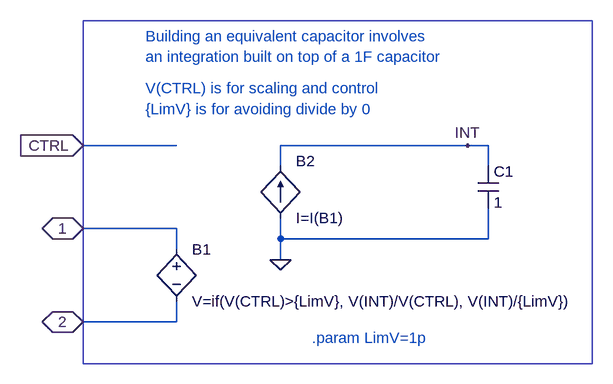
[diagram p0: schematic Varicap.asc]
Varicap.asc, the LTspice schematic file:
Version 4
SHEET 1 880 680
WIRE 112 -64 -32 -64
WIRE 560 -64 272 -64
WIRE 592 -64 560 -64
WIRE 272 -32 272 -64
WIRE 592 -32 592 -64
WIRE 112 64 -32 64
WIRE 272 80 272 48
WIRE 592 80 592 32
WIRE 592 80 272 80
WIRE 112 96 112 64
WIRE 272 112 272 80
WIRE 112 208 112 176
WIRE 112 208 -32 208
FLAG -32 64 1
IOPIN -32 64 BiDir
FLAG -32 208 2
IOPIN -32 208 BiDir
FLAG 272 112 0
FLAG -32 -64 CTRL
IOPIN -32 -64 In
FLAG 560 -64 INT
SYMBOL bv 112 80 R0
SYMATTR InstName B1
SYMATTR Value V=if(V(CTRL)>{LimV}, V(INT)/V(CTRL), V(INT)/{LimV})
SYMBOL bi 272 48 M180
WINDOW 0 24 88 Left 0
WINDOW 3 24 0 Left 0
SYMATTR InstName B2
SYMATTR Value I=I(B1)
SYMBOL cap 576 -32 R0
SYMATTR InstName C1
SYMATTR Value 1
SYMATTR SpiceLine Rpar=1meg
TEXT 64 -232 Left 0 ;Building an equivalent capacitor involves\nan integration built on top of a 1F capacitor
TEXT 64 -152 Left 0 ;V(CTRL) is for scaling and control
TEXT 64 -120 Left 0 ;{LimV} is for avoiding divide by 0
TEXT 320 232 Left 0 ;.param LimV=1p
RECTANGLE Normal 752 272 -32 -256

The netlist it stands for:
* Varicap.asc
B1 1 2 V=if(V(CTRL)>{LimV}, V(INT)/V(CTRL), V(INT)/{LimV})
B2 0 INT I=I(B1)
C1 INT 0 1 Rpar=1meg
* Building an equivalent capacitor involves
* an integration built on top of a 1F capacitor
* V(CTRL) is for scaling and control
* {LimV} is for avoiding divide by 0
* .param LimV=1p
.backanno
.end